# Altium schematic sheet Power_Supply.SchDoc: РПУ
size 420 x 297 mm; ApprovedBy: {Утвердил}; CheckedBy: Коровин; DrawnBy: Овчинников; DocumentNumber: АБВГ 123456.789 00; SheetNumber: 1; SheetTotal: 11; Scale: {Мш.}; PageSetup: Record=PageOptions|CenterHorizontal=False|CenterVertical=False|PrintScale=0.95|XCorrection=0.00|YCorrection=0.00|PrintKind=1|BorderSize=5000000|LeftOffset=0|BottomOffset=0|Orientation=1|PaperLength=1000|PaperWidth=1000|Scale=100|PaperSource=15|PrintQuality=600|MediaType=1|DitherType=10|PaperKind=A4|PrintScaleMode=1; ProcessInspection: {Т.контр.}; Mass: {М.}; NormInspection: {Н.контр.}; Letter1Column: {}; Letter2Column: {}; Letter3Column: {}; DocumentType: Схема; Rule: PcbType=ProtelPcb
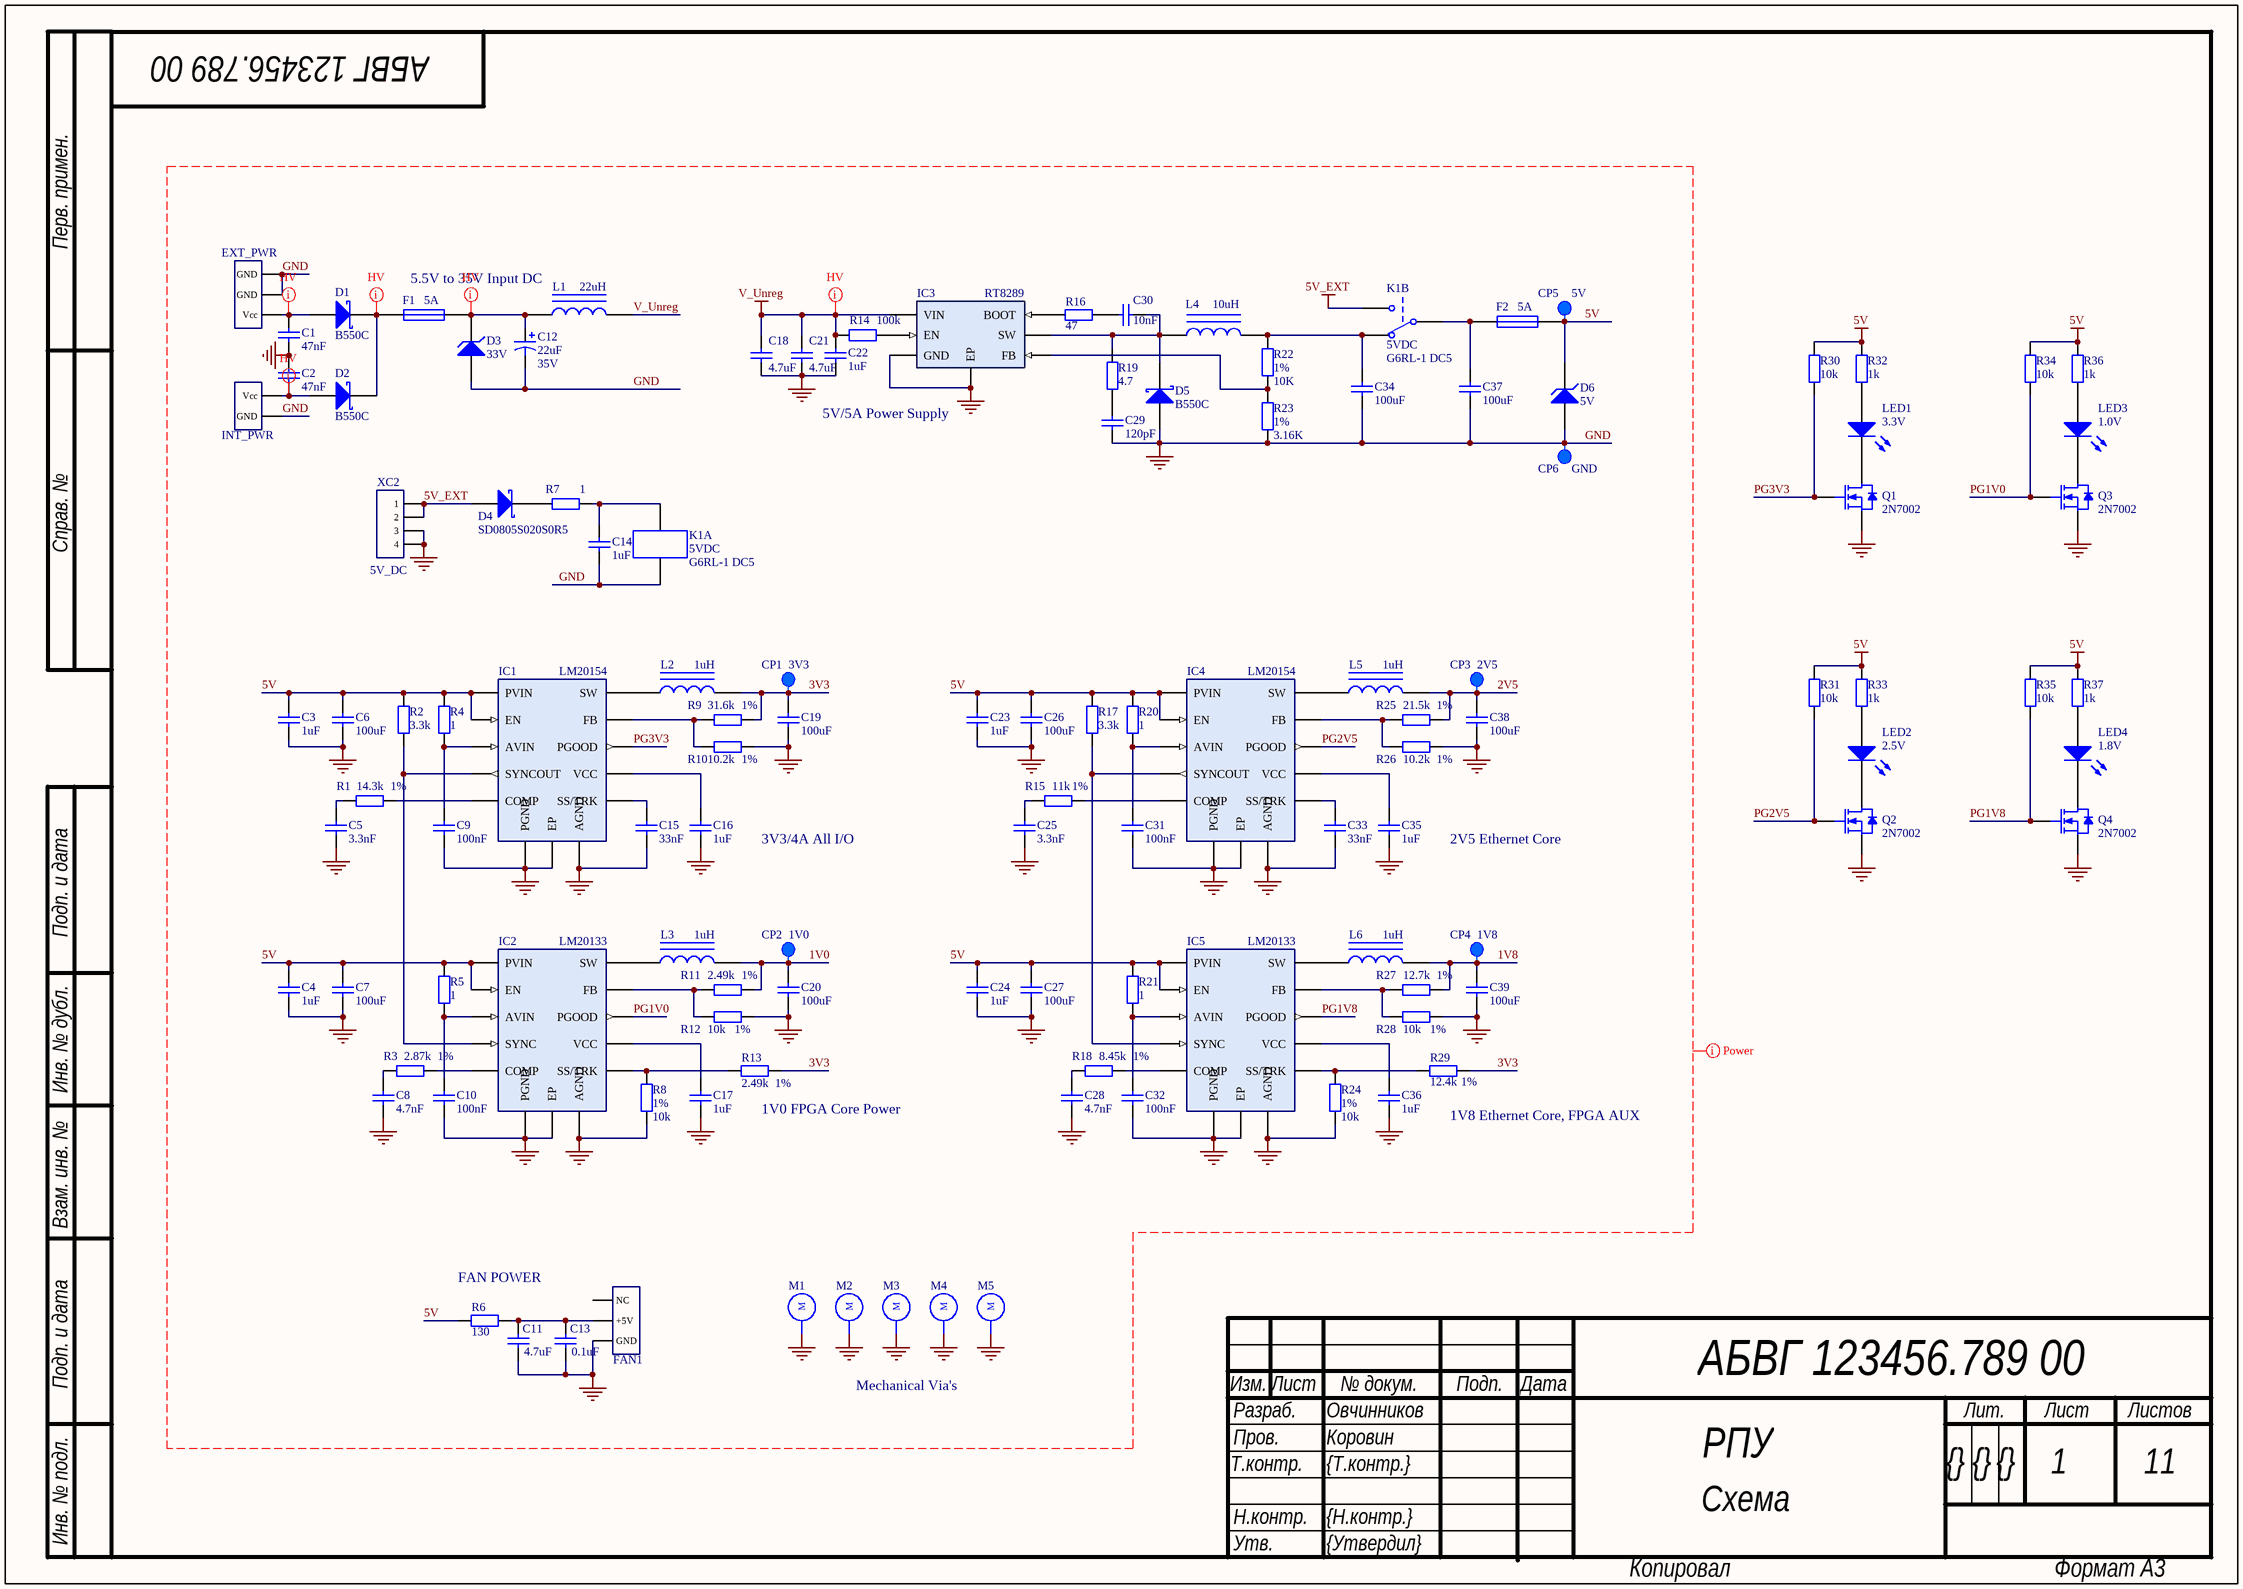
[diagram p0: Power_Supply.SchDoc]

## Parts
C1  value 47nF  [C0805]  (hidden comment: Cap)
C2  value 47nF  [C0805]  (hidden comment: Cap)
C3  value 1uF  [C0805]  (hidden comment: Cap)
C4  value 1uF  [C0805]  (hidden comment: Cap)
C5  value 3.3nF  [C0603]  (hidden comment: Cap)
C6  value 100uF  [C1210]  (hidden comment: Cap)
C7  value 100uF  [C1210]  (hidden comment: Cap)
C8  value 4.7nF  [C0603]  (hidden comment: Cap)
C9  value 100nF  [C0603]  (hidden comment: Cap)
C10  value 100nF  [C0603]  (hidden comment: Cap)
C11  value 4.7uF  [C0805]  (hidden comment: Cap)
C12  value 22uF  Voltage: 35V  [Tantalum_D]  (hidden comment: Tantalum Cap)
C13  value 0.1uF  [C0805]  (hidden comment: Cap)
C14  value 1uF  [C0805]  (hidden comment: Cap)
C15  value 33nF  [C0603]  (hidden comment: Cap)
C16  value 1uF  [C0603]  (hidden comment: Cap)
C17  value 1uF  [C0603]  (hidden comment: Cap)
C18  value 4.7uF  [C1206]  (hidden comment: Cap)
C19  value 100uF  [C1210]  (hidden comment: Cap)
C20  value 100uF  [C1210]  (hidden comment: Cap)
C21  value 4.7uF  [C1206]  (hidden comment: Cap)
C22  value 1uF  [C1206]  (hidden comment: Cap)
C23  value 1uF  [C0805]  (hidden comment: Cap)
C24  value 1uF  [C0805]  (hidden comment: Cap)
C25  value 3.3nF  [C0603]  (hidden comment: Cap)
C26  value 100uF  [C1210]  (hidden comment: Cap)
C27  value 100uF  [C1210]  (hidden comment: Cap)
C28  value 4.7nF  [C0603]  (hidden comment: Cap)
C29  value 120pF  [C0805]  (hidden comment: Cap)
C30  value 10nF  [C0805]  (hidden comment: Cap)
C31  value 100nF  [C0603]  (hidden comment: Cap)
C32  value 100nF  [C0603]  (hidden comment: Cap)
C33  value 33nF  [C0603]  (hidden comment: Cap)
C34  value 100uF  [C1210]  (hidden comment: Cap)
C35  value 1uF  [C0603]  (hidden comment: Cap)
C36  value 1uF  [C0603]  (hidden comment: Cap)
C37  value 100uF  [C1210]  (hidden comment: Cap)
C38  value 100uF  [C1210]  (hidden comment: Cap)
C39  value 100uF  [C1210]  (hidden comment: Cap)
CP1  3V3  [Control Point]
CP2  1V0  [Control Point]
CP3  2V5  [Control Point]
CP4  1V8  [Control Point]
CP5  5V  [Control Point]
CP6  GND  [Control Point]
D1  B550C  [Diode_SMC]
D2  B550C  [Diode_SMC]
D3  Voltage: 33V  [SMF]  (hidden comment: Supressor)
D4  Name: SD0805S020S0R5  [SD0805]  (hidden comment: D Schottky)
D5  B550C  [Diode_SMC]
D6  Voltage: 5V  [SMF]  (hidden comment: Supressor)
DC_PWR1  EXT_PWR  [DC_CONNECTOR]
F1  Current: 5A  [Fuse]  (hidden comment: Fuse)
F2  Current: 5A  [Fuse]  (hidden comment: Fuse)
FAN1  FAN  [FAN_HDR]  (value not drawn)
IC1  LM20154  [LM201xx]
IC2  LM20133  [LM201xx]
IC3  RT8289  [RT8289]
IC4  LM20154  [LM201xx]
IC5  LM20133  [LM201xx]
K1  5VDC  Name: G6RL-1 DC5  [G6RL]  (parts A,B of 2)
L1  value 22uH  [XAL6060-223]  (hidden comment: Inductor Power)
L2  value 1uH  [Coilcraft MSS1038]  (hidden comment: Inductor Power)
L3  value 1uH  [Coilcraft MSS1038]  (hidden comment: Inductor Power)
L4  value 10uH  [Coilcraft MSS1048]  (hidden comment: Inductor Power)
L5  value 1uH  [Coilcraft MSS1038]  (hidden comment: Inductor Power)
L6  value 1uH  [Coilcraft MSS1038]  (hidden comment: Inductor Power)
LED1  3.3V  [LED_0402_Blue]
LED2  2.5V  [LED_0402_Blue]
LED3  1.0V  [LED_0402_Blue]
LED4  1.8V  [LED_0402_Blue]
M1  Via  [Mechanical_Via]  (value not drawn)
M2  Via  [Mechanical_Via]  (value not drawn)
M3  Via  [Mechanical_Via]  (value not drawn)
M4  Via  [Mechanical_Via]  (value not drawn)
M5  Via  [Mechanical_Via]  (value not drawn)
Q1  2N7002  [SOT-23]
Q2  2N7002  [SOT-23]
Q3  2N7002  [SOT-23]
Q4  2N7002  [SOT-23]
R1  value 14.3k  Tolerance: 1%  [R0603]  (hidden comment: Res)
R2  value 3.3k  [R0603]  (hidden comment: Res)
R3  value 2.87k  Tolerance: 1%  [R0603]  (hidden comment: Res)
R4  value 1  [R0603]  (hidden comment: Res)
R5  value 1  [R0603]  (hidden comment: Res)
R6  value 130  [R0805]  (hidden comment: Res)
R7  value 1  [R0805]  (hidden comment: Res)
R8  value 10k  Tolerance: 1%  [R0603]  (hidden comment: Res)
R9  value 31.6k  Tolerance: 1%  [R0603]  (hidden comment: Res)
R10  value 10.2k  Tolerance: 1%  [R0603]  (hidden comment: Res)
R11  value 2.49k  Tolerance: 1%  [R0603]  (hidden comment: Res)
R12  value 10k  Tolerance: 1%  [R0603]  (hidden comment: Res)
R13  value 2.49k  Tolerance: 1%  [R0603]  (hidden comment: Res)
R14  value 100k  [R0805]  (hidden comment: Res)
R15  value 11k  Tolerance: 1%  [R0603]  (hidden comment: Res)
R16  value 47  [R0805]  (hidden comment: Res)
R17  value 3.3k  [R0603]  (hidden comment: Res)
R18  value 8.45k  Tolerance: 1%  [R0603]  (hidden comment: Res)
R19  value 4.7  [R0805]  (hidden comment: Res)
R20  value 1  [R0603]  (hidden comment: Res)
R21  value 1  [R0603]  (hidden comment: Res)
R22  value 10K  Tolerance: 1%  [R0805]  (hidden comment: Res)
R23  value 3.16K  Tolerance: 1%  [R0805]  (hidden comment: Res)
R24  value 10k  Tolerance: 1%  [R0603]  (hidden comment: Res)
R25  value 21.5k  Tolerance: 1%  [R0603]  (hidden comment: Res)
R26  value 10.2k  Tolerance: 1%  [R0603]  (hidden comment: Res)
R27  value 12.7k  Tolerance: 1%  [R0603]  (hidden comment: Res)
R28  value 10k  Tolerance: 1%  [R0603]  (hidden comment: Res)
R29  value 12.4k  Tolerance: 1%  [R0603]  (hidden comment: Res)
R30  value 10k  [R0402]  (hidden comment: Res)
R31  value 10k  [R0402]  (hidden comment: Res)
R32  value 1k  [R0402]  (hidden comment: Res)
R33  value 1k  [R0402]  (hidden comment: Res)
R34  value 10k  [R0402]  (hidden comment: Res)
R35  value 10k  [R0402]  (hidden comment: Res)
R36  value 1k  [R0402]  (hidden comment: Res)
R37  value 1k  [R0402]  (hidden comment: Res)
XC1  INT_PWR  [2x2 PWR_HDR]
XC2  5V_DC  [H-DAC 64]

## Nets
5V: C3.1 C4.1 C6.1 C7.1 C23.1 C24.2 C26.1 C27.1 CP5.1 D6.1(K) F2.1 IC1.6(PVIN) IC1.12(EN) IC2.6(PVIN) IC2.12(EN) IC4.6(PVIN) IC4.12(EN) IC5.6(PVIN) IC5.12(EN) R2.2 R4.1 R5.1 R6.2 R17.1 R20.1 R21.1 R30.2 R31.2 R32.2 R33.2 R34.2 R35.2 R36.2 R37.2
5V_EXT: D4.2(A) K1.3 XC2.1 XC2.2
GND: C1.1 C2.2 C3.2 C4.2 C5.2 C6.2 C7.2 C8.2 C9.1 C10.2 C11.2 C12.2 C13.2 C14.2 C15.1 C16.1 C17.1 C18.2 C19.2 C20.2 C21.2 C22.2 C23.2 C24.1 C25.2 C26.2 C27.2 C28.2 C29.1 C31.2 C32.2 C33.2 C34.2 C35.1 C36.1 C37.1 C38.1 C39.1 CP6.1 D3.2(A) D5.2(A) D6.2(A) DC_PWR1.2(GND) DC_PWR1.3(GND) FAN1.1(GND) IC1.10(PGND) IC1.15(AGND) IC1.17(EP) IC2.10(PGND) IC2.15(AGND) IC2.17(EP) IC3.6(GND) IC3.9(EP) IC4.10(PGND) IC4.15(AGND) IC4.17(EP) IC5.10(PGND) IC5.15(AGND) IC5.17(EP) K1.1 M1.0(M) M2.0(M) M3.0(M) M4.0(M) M5.0(M) Q1.2(S) Q2.2(S) Q3.2(S) Q4.2(S) R8.1 R10.2 R12.2 R23.1 R24.1 R26.2 R28.2 XC1.1(GND) XC2.3 XC2.4
V_Unreg: C18.1 C21.1 C22.1 IC3.7(VIN) L1.2 R14.2
1V0: C20.1 CP2.1 L3.2 R11.1
1V8: C39.2 CP4.1 L6.2 R27.1
2V5: C38.2 CP3.1 L5.2 R25.1
3V3: C19.1 CP1.1 L2.2 R9.1 R13.1 R29.1
PG1V0: IC2.3(PGOOD) Q3.1(G) R34.1
PG1V8: IC5.3(PGOOD) Q4.1(G) R35.1
PG2V5: IC4.3(PGOOD) Q2.1(G) R31.1
PG3V3: IC1.3(PGOOD) Q1.1(G) R30.1
NetC1_2: C1.2 D1.2(A) DC_PWR1.1(Vcc)
NetC2_1: C2.1 D2.2(A) XC1.2(Vcc)
NetC5_1: C5.1 R1.1
NetC8_1: C8.1 R3.1
NetC9_2: C9.2 IC1.14(AVIN) R4.2
NetC10_1: C10.1 IC2.14(AVIN) R5.2
NetC11_1: C11.1 C13.1 FAN1.2(+5V) R6.1
NetC12_1: C12.1 D3.1(K) F1.2 L1.1
NetC14_1: C14.1 K1.5 R7.1
NetC15_2: C15.2 IC1.1(SS/TRK)
NetC16_2: C16.2 IC1.13(VCC)
NetC17_2: C17.2 IC2.13(VCC)
NetC25_1: C25.1 R15.1
NetC28_1: C28.1 R18.1
NetC29_2: C29.2 R19.2
NetC30_1: C30.1 R16.2
NetC30_2: C30.2 D5.1(K) IC3.8(SW) L4.1 R19.1
NetC31_1: C31.1 IC4.14(AVIN) R20.2
NetC32_1: C32.1 IC5.14(AVIN) R21.2
NetC33_1: C33.1 IC4.1(SS/TRK)
NetC34_1: C34.1 K1.4 L4.2 R22.2
NetC35_2: C35.2 IC4.13(VCC)
NetC36_2: C36.2 IC5.13(VCC)
NetC37_2: C37.2 F2.2 K1.2
NetD1_1: D1.1(K) D2.1(K) F1.1
NetD4_1: D4.1(K) R7.2
NetIC1_2: IC1.2(FB) R9.2 R10.1
NetIC1_4: IC1.4(COMP) R1.2
NetIC1_8: IC1.8(SW) L2.1
NetIC1_16: IC1.16(SYNCOUT) IC2.16(SYNC) R2.1
NetIC2_1: IC2.1(SS/TRK) R8.2 R13.2
NetIC2_2: IC2.2(FB) R11.2 R12.1
NetIC2_4: IC2.4(COMP) R3.2
NetIC2_8: IC2.8(SW) L3.1
NetIC3_1: IC3.1(BOOT) R16.1
NetIC3_4: IC3.4(FB) R22.1 R23.2
NetIC3_5: IC3.5(EN) R14.1
NetIC4_2: IC4.2(FB) R25.2 R26.1
NetIC4_4: IC4.4(COMP) R15.2
NetIC4_8: IC4.8(SW) L5.1
NetIC4_16: IC4.16(SYNCOUT) IC5.16(SYNC) R17.2
NetIC5_1: IC5.1(SS/TRK) R24.2 R29.2
NetIC5_2: IC5.2(FB) R27.2 R28.1
NetIC5_4: IC5.4(COMP) R18.2
NetIC5_8: IC5.8(SW) L6.1
NetLED1_1: LED1.1(K) Q1.3(D)
NetLED1_2: LED1.2(A) R32.1
NetLED2_1: LED2.1(K) Q2.3(D)
NetLED2_2: LED2.2(A) R33.1
NetLED3_1: LED3.1(K) Q3.3(D)
NetLED3_2: LED3.2(A) R36.1
NetLED4_1: LED4.1(K) Q4.3(D)
NetLED4_2: LED4.2(A) R37.1

Not connected (* = marked no-connect by the designer): FAN1 3(NC)

## Layout directives
net class Power: 1V0, 1V8, 2V5, 3V3, 5V, 5V_EXT, GND, PG1V0, PG1V8, PG2V5, PG3V3, V_Unreg
net class HV: NetC1_2, NetC2_1, NetC12_1, NetD1_1, V_Unreg

## Notes on the sheet
- 5.5V to 35V Input DC
- 5V/5A Power Supply
- 3V3/4A All I/O
- 2V5 Ethernet Core
- (near R13) 1V0 FPGA Core Power
- (near R29) 1V8 Ethernet Core, FPGA AUX
- FAN POWER
- Mechanical Via's
- Перв. примен.
- Справ. №
- Подп. и дата
- Инв. № дубл.
- Взам. инв. №
- Изм.
- Лист
- № докум.
- Подп.
- Дата
- Т.контр.
- Пров.
- Разраб.
- Лит.
- Листов
- Инв. № подл.
- Н.контр.
- Утв.
- Копировал
- Формат А3

## Library data of the parts
C1 C2 C18 C21 C22 C29 C30 = Cer Cap: Cer Cap Small; Manufacturer: Murata; Material: x7r; Voltage: 50V; Tolerance: 10%; Type: Ceramic; PackageReference: SMD Chip Capacitor
  C1 C2 C29 C30: Package: 0805
  C18 C21 C22: Package: 1206
C3 C4 C11 C13 C23 C24 = Cer Cap: Cer Cap Small; Manufacturer: Murata; Material: x5r; Voltage: 16V; Tolerance: 10%; Type: Ceramic; PackageReference: SMD Chip Capacitor; Package: 0805
C5 C8 C25 C28 = Cer Cap: Cer Cap Small; Manufacturer: Murata; Material: x5r; Voltage: 25V; Tolerance: 10%; Type: Ceramic; PackageReference: SMD Chip Capacitor; Package: 0603
C6 C7 C19 C20 C26 C27 C34 C37-C39 = Cap uF: Cer Cap Large; Manufacturer: Murata; Material: x5r; Tolerance: 20%; Voltage: 6.3V; Type: Ceramic; Package: C1210; PackageDescription: SMD Chip Capacitor
C9 C10 C14 C31 C32 = Cer Cap: Cer Cap Small; Manufacturer: Murata; Material: x7r; Voltage: 16V; Tolerance: 10%; Type: Ceramic; PackageReference: SMD Chip Capacitor
  C9 C10 C31 C32: Package: 0603
  C14: Package: 0805
C12 = Tantalum Cap: Tantalum Polarity Cap; Manufacturer: Tecap; Name: Tantalum Capacitor; Tolerance: 20%; Type: Tantalum Polarity Cap; Temperature Range: -55…85; Package: Chip Capacitor Type D
C15 C33 = Cer Cap: Cer Cap Small; Manufacturer: Murata; Material: x7r; Voltage: 25V; Tolerance: 10%; Type: Ceramic; PackageReference: SMD Chip Capacitor; Package: 0603
C16 C17 C35 C36 = Cer Cap: Cer Cap Small; Manufacturer: Murata; Material: x5r; Voltage: 6.3V; Tolerance: 10%; Type: Ceramic; PackageReference: SMD Chip Capacitor; Package: 0603
CP1-CP6 = Control Point: Name: Control Point
D1 D2 D5 = B550C: Schottky Diode; Package: SMC; Name: B550C
D3 = Supressor: 33V Supressor; Name: SMF33A; Power: 200W; Package: SOD-123FL
D4 = D Schottky: Schottky Diode SMD; Manufacturer: AVX Corporation; Voltage: 20V; Current: 0.5A; Forward Voltage: 440mV@500mA; Type: Schottky Barrier Rectifier Diode; Package: SMD
D6 = Supressor: Name: SMF5.0A; Power: 200W; Package: SOT-123FL
DC_PWR1 = DC_Connector: DC Power Connector 6mm; Current: 5A; Voltage: 12V; Name: DC Power Connector; Type: 2.5mm*5.7mm; Package: through hole
F1 F2 = Fuse: Chip SMD Fuse; Name: Fast Fuse; Type: Fast Chip SMD Fuse; Voltage: 125V; Package: SMD Omni Block
FAN1 = FAN Connector: Current: 5A; Voltage: 12V; Name: FAN Connector; Package: through hole
IC1 IC4 = LM20154: Synchrous Buck Regulator; Current: 4A; Frequency: 1MHz; Input Voltage: 2.95V to 5.5V; Type: Synchrous Buck Regulator; Temperature Range: −40°C to + 125°C; Name: LM20154; Package: HTSSOP
IC2 IC5 = LM20133: Synchronous Buck Regulator; Input Voltage: 2.95V to 5.5V; Frequency: 500 kHz to 1.5 MHz; Current: 3A; Temperature Range: −40°C to + 125°C; Type: Synchronous Buck Regulator; Name: LM20133; Package: HTSSOP
IC3 = RT8289: Step-Down Converter; Current: 5A; Voltage: 32V; Frequency: 500 kHz; Name: RT8289; Package: SOP-8
K1 = Relay-SPDT_G6RL: Single-Pole Dual-Throw Relay; Manufacturer: Omron; Switch Current: 8A max; Type: Compact Single-pole Relay; Voltage: 5VDC
L1 = Inductor Power: Magnetic-Core Inductor; Manufacturer: Coilcraft; Tolerance: ±30%; Current: 5A; Package: XAL6060; Temperature Range: -40ºC to 125ºC; Name: XAL6060-223
L2 L3 L5 L6 = Inductor Power: Magnetic-Core Inductor; Manufacturer: Coilcraft; Tolerance: ±30%; Name: MSS1038; Current: 5A; Package: Chip Inductor; Temperature Range: -40ºC to 125ºC
L4 = Inductor Power: Magnetic-Core Inductor; Manufacturer: Coilcraft; Tolerance: ±30%; Name: MSS1048; Current: 5A; Package: 1048; Temperature Range: -40ºC to 125ºC
LED1-LED4 = LED: Typical RED, GREEN, YELLOW, AMBER GaAs LED; Manufacturer: Kingbright; Color: Blue; P/N: APHHS1005QBC/D; Package: 0402; Name: LED
M1-M5 = Mechanical_Via: Mechanical Via
Q1-Q4 = 2N7002: N-Channel MOSFET 2N7002; Current: 300mA; Voltage: 60V; Channel Resistance: 5Ohm; Power Dissipation: 0.83W; Name: 2N7002; Type: N-Channel MOSFET; Package: SOT-23
R1 R3 R8-R13 R15 R18 R22-R29 = Res: Resistor; Name: Chip SMD Resistor; Power: 0.062 Wt; Temperature Range: -55…155
  R1 R3 R8-R13 R15 R18 R24-R29: Package: 0603
  R22 R23: Package: 0805
R2 R4-R7 R14 R16 R17 R19-R21 R30-R37 = Res: Resistor; Name: Chip SMD Resistor; Tolerance: 5%; Power: 0.062 Wt; Temperature Range: -55…155
  R2 R4 R5 R17 R20 R21: Package: 0603
  R6 R7 R14 R16 R19: Package: 0805
  R30-R37: Package: 0402
XC1 = 1x2 Pwr_Hdr: Power Connector Mini-Fit; Name: Mini-Fit Power Connector; Current: 5A; Voltage: 12V; Type: 1x2; Package: Through Hole
XC2 = H-DAC PCB Connector: Manufacturer: Molex; Part Number: 0311010040; Name: PCB Header; Voltage: 500V; Current: 7.0 A; Mate With: H-DAC 64™ 31068 Series; Mate With P/N: 0310681010; Type: Vertical; Package: Through Hole; Series: H-DAC 64™ 31101; P/N: 0311010040